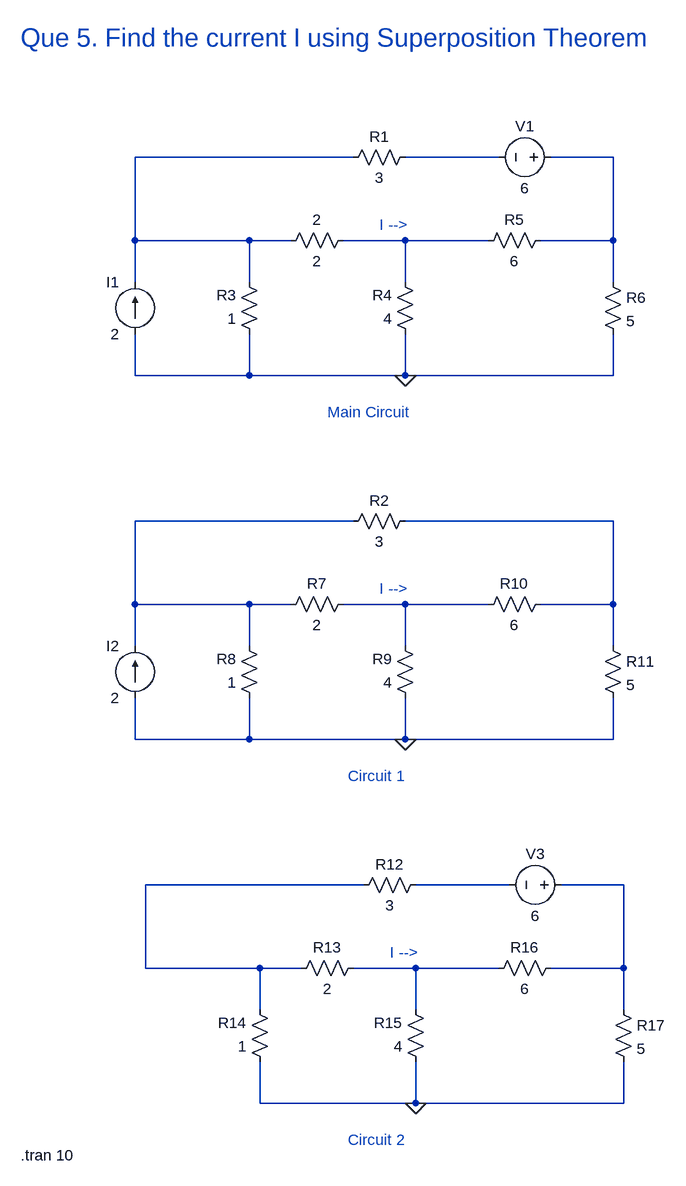
[diagram p0: schematic 5_Dheerendra_23EE019_Superposition_5.asc]
5_Dheerendra_23EE019_Superposition_5.asc, the LTspice schematic file:
Version 4
SHEET 1 928 1776
WIRE 384 224 48 224
WIRE 608 224 464 224
WIRE 784 224 688 224
WIRE 48 352 48 224
WIRE 224 352 48 352
WIRE 288 352 224 352
WIRE 464 352 368 352
WIRE 592 352 464 352
WIRE 784 352 784 224
WIRE 784 352 672 352
WIRE 48 416 48 352
WIRE 224 416 224 352
WIRE 464 416 464 352
WIRE 784 416 784 352
WIRE 48 560 48 496
WIRE 224 560 224 496
WIRE 224 560 48 560
WIRE 464 560 464 496
WIRE 464 560 224 560
WIRE 784 560 784 496
WIRE 784 560 464 560
WIRE 384 784 48 784
WIRE 784 784 464 784
WIRE 48 912 48 784
WIRE 224 912 48 912
WIRE 288 912 224 912
WIRE 464 912 368 912
WIRE 592 912 464 912
WIRE 784 912 784 784
WIRE 784 912 672 912
WIRE 48 976 48 912
WIRE 224 976 224 912
WIRE 464 976 464 912
WIRE 784 976 784 912
WIRE 48 1120 48 1056
WIRE 224 1120 224 1056
WIRE 224 1120 48 1120
WIRE 464 1120 464 1056
WIRE 464 1120 224 1120
WIRE 784 1120 784 1056
WIRE 784 1120 464 1120
WIRE 400 1344 64 1344
WIRE 624 1344 480 1344
WIRE 800 1344 704 1344
WIRE 64 1472 64 1344
WIRE 240 1472 64 1472
WIRE 304 1472 240 1472
WIRE 480 1472 384 1472
WIRE 608 1472 480 1472
WIRE 800 1472 800 1344
WIRE 800 1472 688 1472
WIRE 240 1536 240 1472
WIRE 480 1536 480 1472
WIRE 800 1536 800 1472
WIRE 240 1680 240 1616
WIRE 480 1680 480 1616
WIRE 480 1680 240 1680
WIRE 800 1680 800 1616
WIRE 800 1680 480 1680
FLAG 464 560 0
FLAG 464 1120 0
FLAG 480 1680 0
SYMBOL res 480 208 R90
WINDOW 0 0 56 VBottom 2
WINDOW 3 32 56 VTop 2
SYMATTR InstName R1
SYMATTR Value 3
SYMBOL res 384 336 R90
WINDOW 0 0 56 VBottom 2
WINDOW 3 32 56 VTop 2
SYMATTR InstName 2
SYMATTR Value 2
SYMBOL res 240 512 R180
WINDOW 0 36 76 Left 2
WINDOW 3 36 40 Left 2
SYMATTR InstName R3
SYMATTR Value 1
SYMBOL res 480 512 R180
WINDOW 0 36 76 Left 2
WINDOW 3 36 40 Left 2
SYMATTR InstName R4
SYMATTR Value 4
SYMBOL res 576 368 R270
WINDOW 0 32 56 VTop 2
WINDOW 3 0 56 VBottom 2
SYMATTR InstName R5
SYMATTR Value 6
SYMBOL res 768 400 R0
SYMATTR InstName R6
SYMATTR Value 5
SYMBOL voltage 704 224 R90
WINDOW 0 -32 56 VBottom 2
WINDOW 3 32 56 VTop 2
WINDOW 123 0 0 Left 0
WINDOW 39 0 0 Left 0
SYMATTR InstName V1
SYMATTR Value 6
SYMBOL current 48 496 R180
WINDOW 0 24 80 Left 2
WINDOW 3 24 0 Left 2
WINDOW 123 0 0 Left 0
WINDOW 39 0 0 Left 0
SYMATTR InstName I1
SYMATTR Value 2
SYMBOL res 480 768 R90
WINDOW 0 0 56 VBottom 2
WINDOW 3 32 56 VTop 2
SYMATTR InstName R2
SYMATTR Value 3
SYMBOL res 384 896 R90
WINDOW 0 0 56 VBottom 2
WINDOW 3 32 56 VTop 2
SYMATTR InstName R7
SYMATTR Value 2
SYMBOL res 240 1072 R180
WINDOW 0 36 76 Left 2
WINDOW 3 36 40 Left 2
SYMATTR InstName R8
SYMATTR Value 1
SYMBOL res 480 1072 R180
WINDOW 0 36 76 Left 2
WINDOW 3 36 40 Left 2
SYMATTR InstName R9
SYMATTR Value 4
SYMBOL res 576 928 R270
WINDOW 0 32 56 VTop 2
WINDOW 3 0 56 VBottom 2
SYMATTR InstName R10
SYMATTR Value 6
SYMBOL res 768 960 R0
SYMATTR InstName R11
SYMATTR Value 5
SYMBOL current 48 1056 R180
WINDOW 0 24 80 Left 2
WINDOW 3 24 0 Left 2
WINDOW 123 0 0 Left 0
WINDOW 39 0 0 Left 0
SYMATTR InstName I2
SYMATTR Value 2
SYMBOL res 496 1328 R90
WINDOW 0 0 56 VBottom 2
WINDOW 3 32 56 VTop 2
SYMATTR InstName R12
SYMATTR Value 3
SYMBOL res 400 1456 R90
WINDOW 0 0 56 VBottom 2
WINDOW 3 32 56 VTop 2
SYMATTR InstName R13
SYMATTR Value 2
SYMBOL res 256 1632 R180
WINDOW 0 36 76 Left 2
WINDOW 3 36 40 Left 2
SYMATTR InstName R14
SYMATTR Value 1
SYMBOL res 496 1632 R180
WINDOW 0 36 76 Left 2
WINDOW 3 36 40 Left 2
SYMATTR InstName R15
SYMATTR Value 4
SYMBOL res 592 1488 R270
WINDOW 0 32 56 VTop 2
WINDOW 3 0 56 VBottom 2
SYMATTR InstName R16
SYMATTR Value 6
SYMBOL res 784 1520 R0
SYMATTR InstName R17
SYMATTR Value 5
SYMBOL voltage 720 1344 R90
WINDOW 0 -32 56 VBottom 2
WINDOW 3 32 56 VTop 2
WINDOW 123 0 0 Left 0
WINDOW 39 0 0 Left 0
SYMATTR InstName V3
SYMATTR Value 6
TEXT -128 40 Left 4 ;Que 5. Find the current I using Superposition Theorem
TEXT 424 328 Left 2 ;I -->
TEXT 424 888 Left 2 ;I -->
TEXT 440 1448 Left 2 ;I -->
TEXT 344 616 Left 2 ;Main Circuit
TEXT 376 1176 Left 2 ;Circuit 1
TEXT 376 1736 Left 2 ;Circuit 2
TEXT -128 1760 Left 2 !.tran 10

The netlist it stands for:
* 5_Dheerendra_23EE019_Superposition_5.asc
R1 N002 N001 3
R§2 N004 N001 2
R3 0 N001 1
R4 0 N004 4
R5 N004 N003 6
R6 N003 0 5
V1 N003 N002 6
I1 0 N001 2
R2 N006 N005 3
R7 N007 N005 2
R8 0 N005 1
R9 0 N007 4
R10 N007 N006 6
R11 N006 0 5
I2 0 N005 2
R12 N009 N008 3
R13 N011 N008 2
R14 0 N008 1
R15 0 N011 4
R16 N011 N010 6
R17 N010 0 5
V3 N010 N009 6
* Que 5. Find the current I using Superposition Theorem
* I -->
* I -->
* I -->
* Main Circuit
* Circuit 1
* Circuit 2
.tran 10
.backanno
.end